# Altium schematic sheet 16-PPSMUX_DPLLSMAMUX.SchDoc
size B; SheetNumber: 16; SheetTotal: 16
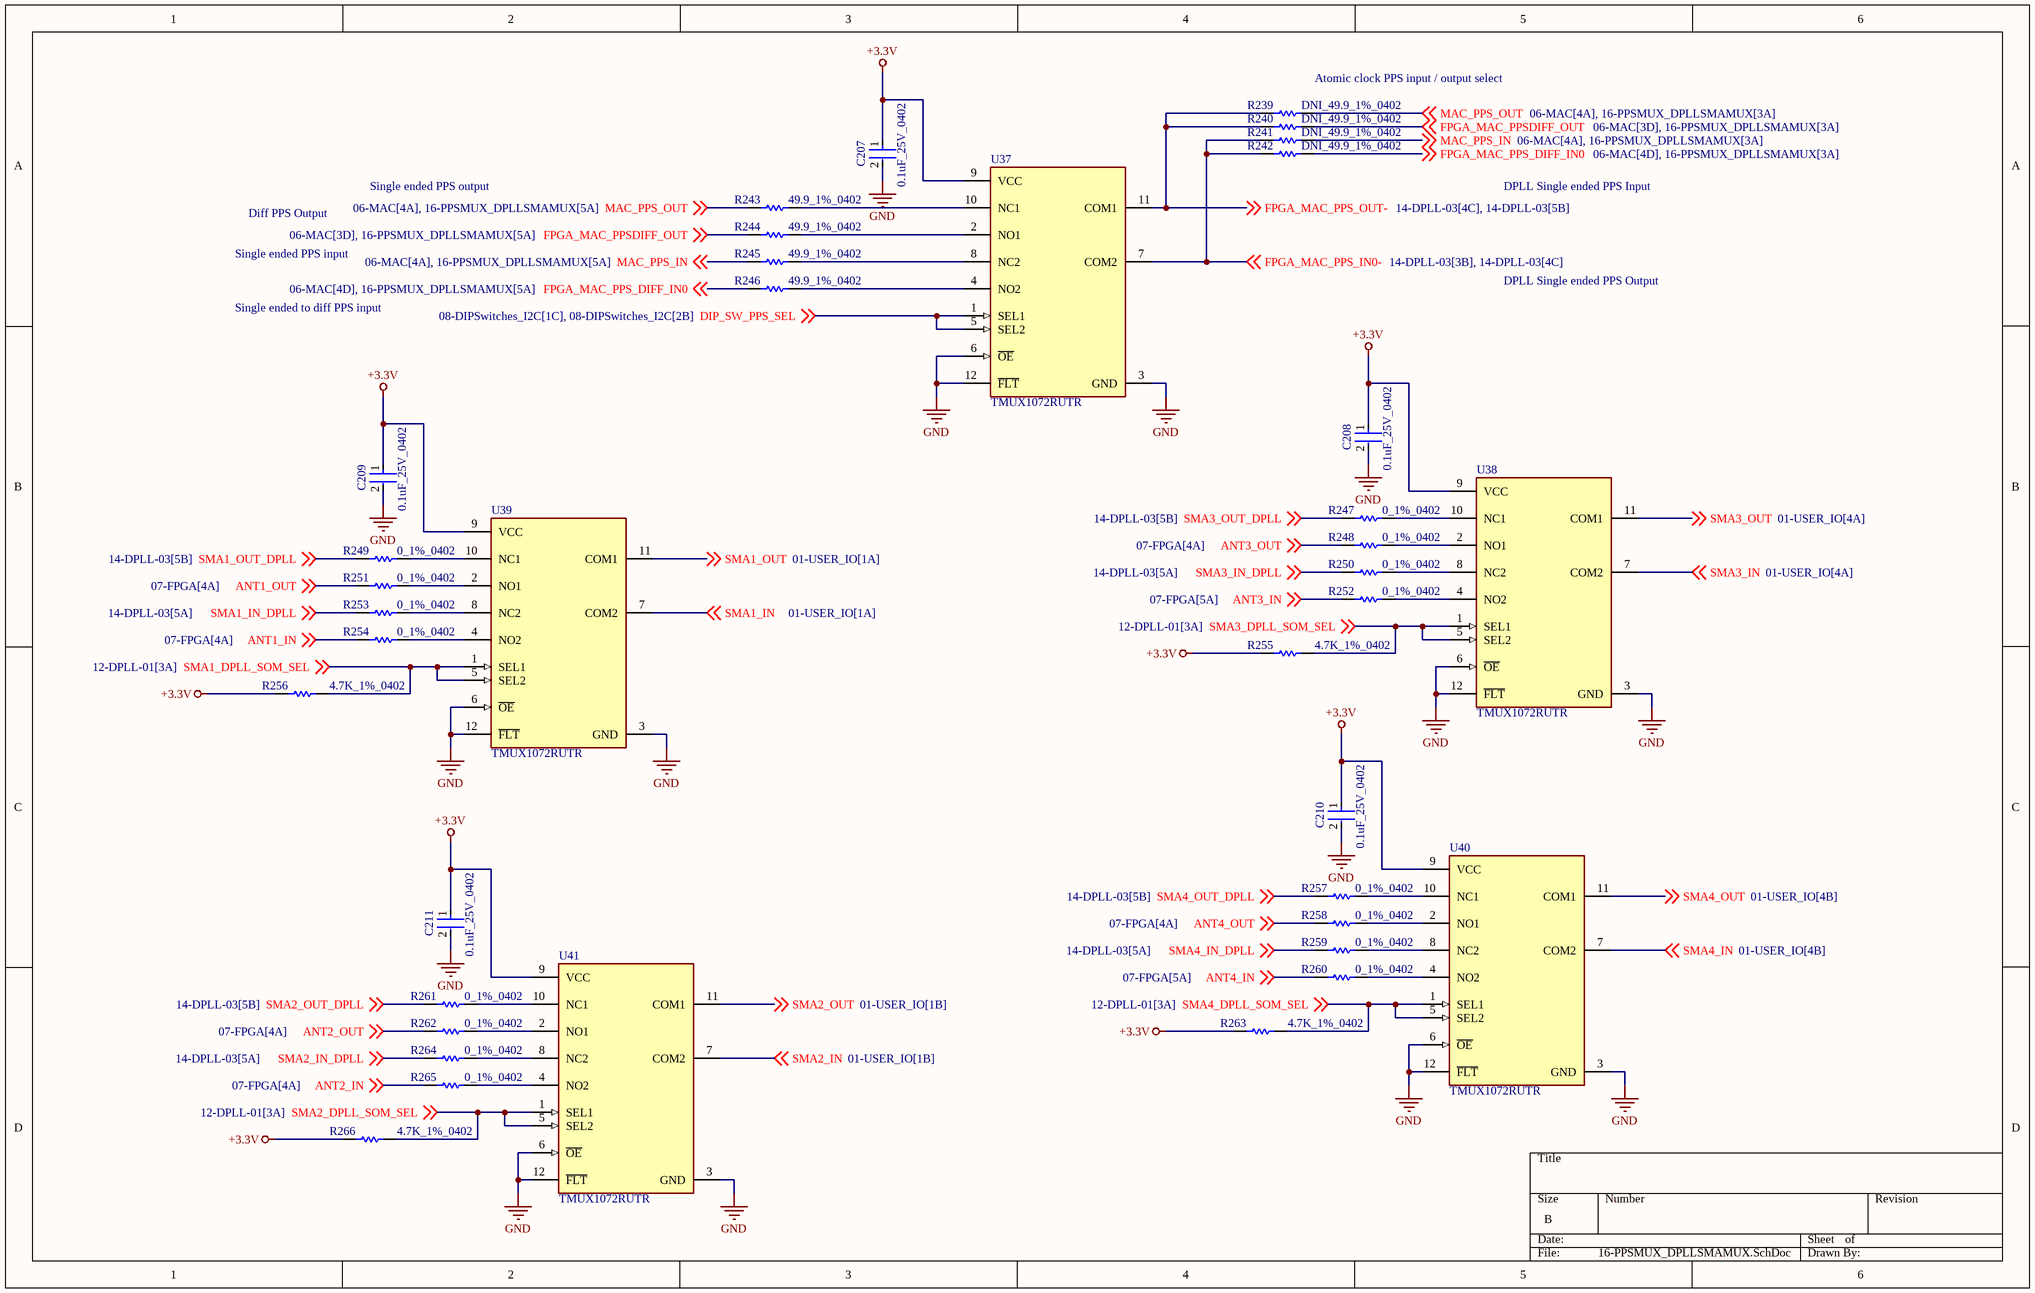
[diagram p0: 16-PPSMUX_DPLLSMAMUX.SchDoc]

## Parts
C207  0.1uF_25V_0402  [FP-0402-L_1_0_1-W_0_5_0_1-IPC_C]
C208  0.1uF_25V_0402  [FP-0402-L_1_0_1-W_0_5_0_1-IPC_C]
C209  0.1uF_25V_0402  [FP-0402-L_1_0_1-W_0_5_0_1-IPC_C]
C210  0.1uF_25V_0402  [FP-0402-L_1_0_1-W_0_5_0_1-IPC_C]
C211  0.1uF_25V_0402  [FP-0402-L_1_0_1-W_0_5_0_1-IPC_C]
R239  DNI_49.9_1%_0402  [RESC1005X40X25LL05T10]  (no BOM)
R240  DNI_49.9_1%_0402  [RESC1005X40X25LL05T10]  (no BOM)
R241  DNI_49.9_1%_0402  [RESC1005X40X25LL05T10]  (no BOM)
R242  DNI_49.9_1%_0402  [RESC1005X40X25LL05T10]  (no BOM)
R243  49.9_1%_0402  [RESC1005X40X25LL05T10]
R244  49.9_1%_0402  [RESC1005X40X25LL05T10]
R245  49.9_1%_0402  [RESC1005X40X25LL05T10]
R246  49.9_1%_0402  [RESC1005X40X25LL05T10]
R247  0_1%_0402  [RESC1005X40X25LL05T05]
R248  0_1%_0402  [RESC1005X40X25LL05T05]
R249  0_1%_0402  [RESC1005X40X25LL05T05]
R250  0_1%_0402  [RESC1005X40X25LL05T05]
R251  0_1%_0402  [RESC1005X40X25LL05T05]
R252  0_1%_0402  [RESC1005X40X25LL05T05]
R253  0_1%_0402  [RESC1005X40X25LL05T05]
R254  0_1%_0402  [RESC1005X40X25LL05T05]
R255  4.7K_1%_0402  [RESC1005X40X25NL10T10]
R256  4.7K_1%_0402  [RESC1005X40X25NL10T10]
R257  0_1%_0402  [RESC1005X40X25LL05T05]
R258  0_1%_0402  [RESC1005X40X25LL05T05]
R259  0_1%_0402  [RESC1005X40X25LL05T05]
R260  0_1%_0402  [RESC1005X40X25LL05T05]
R261  0_1%_0402  [RESC1005X40X25LL05T05]
R262  0_1%_0402  [RESC1005X40X25LL05T05]
R263  4.7K_1%_0402  [RESC1005X40X25NL10T10]
R264  0_1%_0402  [RESC1005X40X25LL05T05]
R265  0_1%_0402  [RESC1005X40X25LL05T05]
R266  4.7K_1%_0402  [RESC1005X40X25NL10T10]
U37  TMUX1072RUTR  [FP-RUT0012A-MFG]
U38  TMUX1072RUTR  [FP-RUT0012A-MFG]
U39  TMUX1072RUTR  [FP-RUT0012A-MFG]
U40  TMUX1072RUTR  [FP-RUT0012A-MFG]
U41  TMUX1072RUTR  [FP-RUT0012A-MFG]

## Nets
+3.3V: C207.1 C208.1 C209.1 C210.1 C211.1 R255.2 R256.2 R263.2 R266.2 U37.9(VCC) U38.9(VCC) U39.9(VCC) U40.9(VCC) U41.9(VCC)
GND: C207.2 C208.2 C209.2 C210.2 C211.2 U37.3(GND) U37.6(~{OE}) U37.12(~{FLT}) U38.3(GND) U38.6(~{OE}) U38.12(~{FLT}) U39.3(GND) U39.6(~{OE}) U39.12(~{FLT}) U40.3(GND) U40.6(~{OE}) U40.12(~{FLT}) U41.3(GND) U41.6(~{OE}) U41.12(~{FLT})
ANT1_IN: R254.1 ; off-sheet ANT1_IN
ANT1_OUT: R251.1 ; off-sheet ANT1_OUT
ANT2_IN: R265.1 ; off-sheet ANT2_IN
ANT2_OUT: R262.1 ; off-sheet ANT2_OUT
ANT3_IN: R252.1 ; off-sheet ANT3_IN
ANT3_OUT: R248.1 ; off-sheet ANT3_OUT
ANT4_IN: R260.1 ; off-sheet ANT4_IN
ANT4_OUT: R258.1 ; off-sheet ANT4_OUT
DIP_SW_PPS_SEL: U37.1(SEL1) U37.5(SEL2) ; off-sheet DIP_SW_PPS_SEL
FPGA_MAC_PPS_DIFF_IN0: R242.2 R246.1 ; off-sheet FPGA_MAC_PPS_DIFF_IN0
FPGA_MAC_PPS_IN0-: R241.1 R242.1 U37.7(COM2) ; off-sheet FPGA_MAC_PPS_IN0-
FPGA_MAC_PPS_OUT-: R239.1 R240.1 U37.11(COM1) ; off-sheet FPGA_MAC_PPS_OUT-
FPGA_MAC_PPSDIFF_OUT: R240.2 R244.1 ; off-sheet FPGA_MAC_PPSDIFF_OUT
MAC_PPS_IN: R241.2 R245.1 ; off-sheet MAC_PPS_IN
MAC_PPS_OUT: R239.2 R243.1 ; off-sheet MAC_PPS_OUT
SMA1_DPLL_SOM_SEL: R256.1 U39.1(SEL1) U39.5(SEL2) ; off-sheet SMA1_DPLL_SOM_SEL
SMA1_IN: U39.7(COM2) ; off-sheet SMA1_IN
SMA1_IN_DPLL: R253.1 ; off-sheet SMA1_IN_DPLL
SMA1_OUT: U39.11(COM1) ; off-sheet SMA1_OUT
SMA1_OUT_DPLL: R249.1 ; off-sheet SMA1_OUT_DPLL
SMA2_DPLL_SOM_SEL: R266.1 U41.1(SEL1) U41.5(SEL2) ; off-sheet SMA2_DPLL_SOM_SEL
SMA2_IN: U41.7(COM2) ; off-sheet SMA2_IN
SMA2_IN_DPLL: R264.1 ; off-sheet SMA2_IN_DPLL
SMA2_OUT: U41.11(COM1) ; off-sheet SMA2_OUT
SMA2_OUT_DPLL: R261.1 ; off-sheet SMA2_OUT_DPLL
SMA3_DPLL_SOM_SEL: R255.1 U38.1(SEL1) U38.5(SEL2) ; off-sheet SMA3_DPLL_SOM_SEL
SMA3_IN: U38.7(COM2) ; off-sheet SMA3_IN
SMA3_IN_DPLL: R250.1 ; off-sheet SMA3_IN_DPLL
SMA3_OUT: U38.11(COM1) ; off-sheet SMA3_OUT
SMA3_OUT_DPLL: R247.1 ; off-sheet SMA3_OUT_DPLL
SMA4_DPLL_SOM_SEL: R263.1 U40.1(SEL1) U40.5(SEL2) ; off-sheet SMA4_DPLL_SOM_SEL
SMA4_IN: U40.7(COM2) ; off-sheet SMA4_IN
SMA4_IN_DPLL: R259.1 ; off-sheet SMA4_IN_DPLL
SMA4_OUT: U40.11(COM1) ; off-sheet SMA4_OUT
SMA4_OUT_DPLL: R257.1 ; off-sheet SMA4_OUT_DPLL
NetR243_2: R243.2 U37.10(NC1)
NetR244_2: R244.2 U37.2(NO1)
NetR245_2: R245.2 U37.8(NC2)
NetR246_2: R246.2 U37.4(NO2)
NetR247_2: R247.2 U38.10(NC1)
NetR248_2: R248.2 U38.2(NO1)
NetR249_2: R249.2 U39.10(NC1)
NetR250_2: R250.2 U38.8(NC2)
NetR251_2: R251.2 U39.2(NO1)
NetR252_2: R252.2 U38.4(NO2)
NetR253_2: R253.2 U39.8(NC2)
NetR254_2: R254.2 U39.4(NO2)
NetR257_2: R257.2 U40.10(NC1)
NetR258_2: R258.2 U40.2(NO1)
NetR259_2: R259.2 U40.8(NC2)
NetR260_2: R260.2 U40.4(NO2)
NetR261_2: R261.2 U41.10(NC1)
NetR262_2: R262.2 U41.2(NO1)
NetR264_2: R264.2 U41.8(NC2)
NetR265_2: R265.2 U41.4(NO2)

## Notes on the sheet
- Atomic clock PPS input / output select
- Diff PPS Output
- Single ended PPS output
- DPLL Single ended PPS Input
- Single ended PPS input
- DPLL Single ended PPS Output
- Single ended to diff PPS input

## Library data of the parts
C207-C211 = CMP-2008-02519-2: General Purpose Ceramic Capacitor, 0402, 100nF, 10%, X7R, 15%, 25V; Package Quantity: 1; Capacitance: 100nF; Min Operating Temperature: -55°C; Voltage: 25V; Voltage Rating: 25V; Construction: Flat; Max Operating Temperature: 125°C; Radiation Hardening: No; Depth: 0.5mm; Thickness: 0.022inch; Voltage Rating (DC): 25V; Number of Pins: 2; Lead Free: Lead Free; Series: -; REACH SVHC: No SVHC; Length: 1mm; Dielectric: X7R; RoHS Compliant: Yes; Mount: Surface Mount; Packaging: Tape and Reel; Case/Package: 0402; Case Code (Imperial): 0402; Termination: SMD/SMT; Width: 0.02inch; Case Code (Metric): 1005; Tolerance: 10%
R239-R246 = CMP-2002-07709-1: Manufacturer: Yageo / Phycomp; Part Number: RC0402FR-0749R9L
R247-R254 R257-R262 R264 R265 = CMP-2000-07451-1: Chip Resistor, 0 Ohm, 0.1 W, -55 to 155 degC, 0402 (1005 Metric), RoHS, Tape and Reel; Manufacturer: Panasonic; Voltage Rating (DC): 50V; Temperature Coefficient: 600ppm/��C; Max Power Dissipation: 100mW; Resistance: 0mOhm; Tolerance: 5%; Number of Terminations: 2; Mount: SurfaceMount; Height: 0.35mm; Packaging: TapeandReel; Contact Plating: Tin; Manufacturer URL: http://www.panasonic.com/; Composition: ThickFilm; Max Operating Temperature: 155degC; REACH SVHC: NoSVHC; Case/Package: 0402; Package Reference: 402; Depth: 0.5mm; Package Description: 2-Pin Surface Mount Device, Body 1 x 0.5 mm; Datasheet URL: https://industrial.panasonic.com/cdbs/www-data/pdf/RDA0000/AOA0000C301.pdf; RoHSCompliant: True; Case Code (Imperial): 0402; Military Standard: Not; Min Operating Temperature: -55degC; Power Rating: 100mW; Datasheet Version: 03/2015; Length: 1mm; Case Code (Metric): 1005; Termination: SMD/SMT; Mounting Technology: SurfaceMount; Voltage Rating: 50V; Width: 0.02inch; Package Quantity: 1; Lead Free: LeadFree; Radiation Hardening: No
R255 R256 R263 R266 = CMP-2002-05217-1: Manufacturer: Bourns; Part Number: CR0402-FX-4701GLF
U37-U41 = CMP-04892-000114-1: IC SWITCH SPDT DUAL 12UQFN; Number of Circuits: 2; -3db Bandwidth: 1.2GHz; On-State Resistance: 18R; Number of Pins: 12; Min Operating Temperature: -40°C; RoHS Compliant: Yes; Max Operating Temperature: 125°C; Number of Channels: 2; Packaging: Tape and Reel